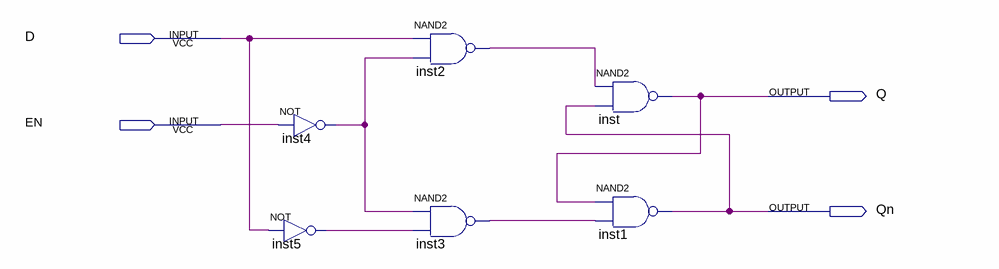
[diagram p0: schematic sheet]
// Quartus schematic Ex7.bdf as structural Verilog: 6 symbols, 4 pins
module Ex7 (
  input  D,
  input  EN,
  output Q,
  output Qn
);

  wire inst2_out, inst3_out, inst4_out, inst5_out;

  not inst4 (inst4_out, EN);
  not inst5 (inst5_out, D);
  nand inst2 (inst2_out, D, inst4_out);
  nand inst3 (inst3_out, inst4_out, inst5_out);
  nand inst (Q, inst2_out, Qn);
  nand inst1 (Qn, Q, inst3_out);
endmodule
